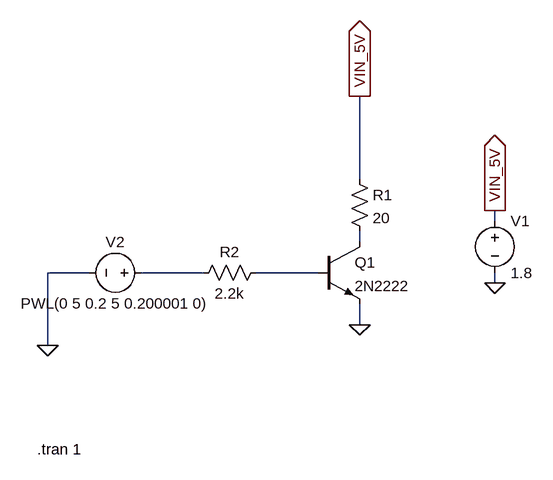
[diagram p0: schematic BJT_Light.asc]
BJT_Light.asc, the LTspice schematic file:
Version 4.1
SHEET 1 880 680
WIRE 208 -96 208 -224
WIRE 416 -32 416 -48
WIRE 208 0 208 -16
WIRE -208 48 -272 48
WIRE -32 48 -128 48
WIRE 144 48 48 48
WIRE 416 64 416 48
WIRE 208 128 208 96
WIRE -272 160 -272 48
FLAG 416 -48 VIN_5V
IOPIN 416 -48 Out
FLAG 416 64 0
FLAG 208 -224 VIN_5V
IOPIN 208 -224 Out
FLAG -272 160 0
FLAG 208 128 0
SYMBOL npn 144 0 R0
SYMATTR InstName Q1
SYMATTR Value 2N2222
SYMBOL voltage 416 -48 R0
WINDOW 123 0 0 Left 0
WINDOW 39 0 0 Left 0
SYMATTR InstName V1
SYMATTR Value 1.8
SYMBOL res 192 -112 R0
SYMATTR InstName R1
SYMATTR Value 20
SYMBOL voltage -112 48 R90
WINDOW 0 -32 56 VBottom 2
WINDOW 3 32 56 VTop 2
WINDOW 123 0 0 Left 0
WINDOW 39 0 0 Left 0
SYMATTR InstName V2
SYMATTR Value PWL(0 5 0.2 5 0.200001 0)
SYMBOL res 64 32 R90
WINDOW 0 0 56 VBottom 2
WINDOW 3 32 56 VTop 2
SYMATTR InstName R2
SYMATTR Value 2.2k
TEXT -288 320 Left 2 !.tran 1

The netlist it stands for:
* BJT_Light.asc
Q1 N001 N003 0 0 2N2222
V1 VIN_5V 0 1.8
R1 VIN_5V N001 20
V2 N002 0 PWL(0 5 0.2 5 0.200001 0)
R2 N003 N002 2.2k
.model NPN NPN
.model PNP PNP
.lib standard.bjt
.tran 1
.backanno
.end